# EAGLE design espmarauder (EAGLE 9.6.2)
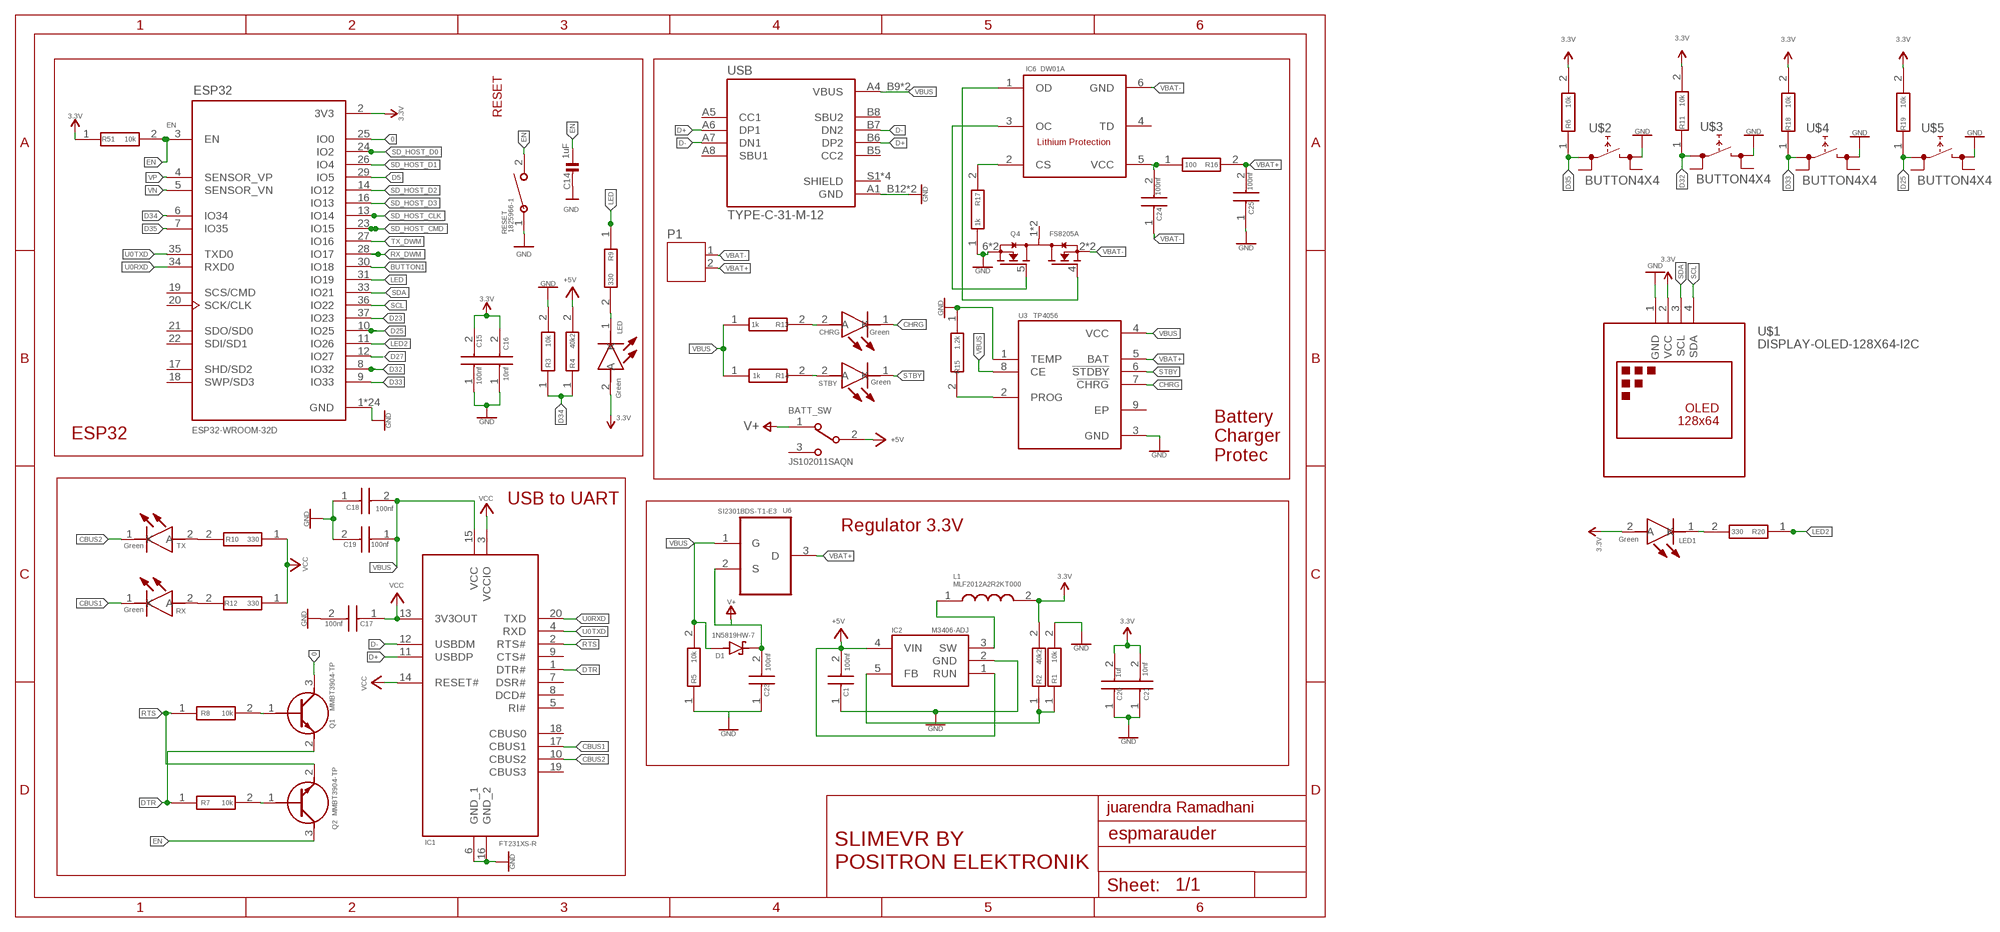
[diagram p0: schematic, sheet 1]

## Parts
BATT_SW  JS102011SAQN  [SW_JS102011SAQN]
C1  100nf  885012206071  [CAPC1608X87N]
C14  1uF  CAP_CERAMIC0603  [0603]
C15  100nf  885012206071  [CAPC1608X87N]
C16  10nf  885012206089  [CAPC1608X87N]
C17  100nf  885012206071  [CAPC1608X87N]
C18  100nf  885012206071  [CAPC1608X87N]
C19  100nf  885012206071  [CAPC1608X87N]
C20  1uf  885012206071  [CAPC1608X87N]
C21  10nf  885012206089  [CAPC1608X87N]
C23  100nf  885012206071  [CAPC1608X87N]
C24  100nf  885012206071  [CAPC1608X87N]
C25  100nf  885012206071  [CAPC1608X87N]
CHRG  Green  150080BS75000  [LEDC2012X80N]
D1  1N5819HW-7  [SOD3715X145N]
ESP32  ESP32-WROOM-32D  [MODULE_ESP32-WROOM-32D]
IC1  FT231XS-R  [SOP64P599X175-20N]
IC2  M3406-ADJ  [SOT95P280X100-5N]
IC6  DW01A  [SOT23-6]
L1  MLF2012A2R2KT000  [INDC2012X105N]
LED  Green  150080BS75000  [LEDC2012X80N]
LED1  Green  150080BS75000  [LEDC2012X80N]
P1  JST-PH2  [JST-PH2]
Q1  MMBT3904-TP  [SI2305TP]
Q2  MMBT3904-TP  [SI2305TP]
Q4  FS8205A  [SOP65P640X120-8N]
R1  10k  ESR03EZPJ103  [RESC1608X55N]
R2  40k2  ERJ-S03F4022V  [RESC1608X55N]
R3  10k  ESR03EZPJ103  [RESC1608X55N]
R4  40k2  ERJ-S03F4022V  [RESC1608X55N]
R5  10k  ESR03EZPJ103  [RESC1608X55N]
R6  10k  ESR03EZPJ103  [RESC1608X55N]
R7  10k  ESR03EZPJ103  [RESC1608X55N]
R8  10k  ESR03EZPJ103  [RESC1608X55N]
R9  330  ERJ-H3EF3300V  [ERJH3]
R10  330  ERJ-H3EF3300V  [ERJH3]
R11  10k  ESR03EZPJ103  [RESC1608X55N]
R12  330  ERJ-H3EF3300V  [ERJH3]
R13  1k  ESR03EZPJ102  [RESC1608X55N]
R14  1k  ESR03EZPJ102  [RESC1608X55N]
R15  1.2k  ESR03EZPJ102  [RESC1608X55N]
R16  100  ESR03EZPJ102  [RESC1608X55N]
R17  1k  ESR03EZPJ102  [RESC1608X55N]
R18  10k  ESR03EZPJ103  [RESC1608X55N]
R19  10k  ESR03EZPJ103  [RESC1608X55N]
R20  330  ERJ-H3EF3300V  [ERJH3]
R51  10k  ESR03EZPJ103  [RESC1608X55N]
RESET  1825966-1  [SWDIP2_256X170P100]
RX  Green  150080BS75000  [LEDC2012X80N]
STBY  Green  150080BS75000  [LEDC2012X80N]
TX  Green  150080BS75000  [LEDC2012X80N]
U3  TP4056  [SOP127P600X175-9N]
U6  SI2301BDS-T1-E3  [SOT95P237X112-3N]
U$1  DISPLAY-OLED-128X64-I2C  [DISPLAY-OLED-128X64-I2C]
U$2  BUTTON4X4  [BUTTON4X4]
U$3  BUTTON4X4  [BUTTON4X4]
U$4  BUTTON4X4  [BUTTON4X4]
U$5  BUTTON4X4  [BUTTON4X4]
USB  TYPE-C-31-M-12  [HRO_TYPE-C-31-M-12]

## Nets
0: ESP32.25(IO0) Q1.3(C)
3.3V: C15.2 C16.2 C20.2 C21.2 ESP32.2(3V3) L1.2 LED1.2(A) LED.2(A) R2.2 R6.2 R11.2 R18.2 R19.2 R51.1 U$1.2(VCC)
+5V: BATT_SW.2 C1.2 IC2.1(RUN) IC2.4(VIN) R4.2
BUTTON1: ESP32.30(IO18)
CBUS1: IC1.17(CBUS1) RX.1(K)
CBUS2: IC1.10(CBUS2) TX.1(K)
CHRG: CHRG.1(K) U3.7(!CHRG)
D5: ESP32.29(IO5)
D23: ESP32.37(IO23)
D25: ESP32.10(IO25) R19.1 U$5.1
D27: ESP32.12(IO27)
D32: ESP32.8(IO32) R11.1 U$3.1
D33: ESP32.9(IO33) R18.1 U$4.1
D34: ESP32.6(IO34) R3.1 R4.1
D35: ESP32.7(IO35) R6.1 U$2.1
D+: IC1.11(USBDP) USB.A6(DP1) USB.B6(DP2)
D-: IC1.12(USBDM) USB.A7(DN1) USB.B7(DN2)
DTR: IC1.1(DTR#) Q1.2(E) R7.1
EN: C14.1 ESP32.3(EN) Q2.3(C) R51.2 RESET.2
GND: C1.1 C14.2 C15.1 C16.1 C17.2 C18.1 C19.2 C20.1 C21.1 C23.1 C25.1 IC1.6(GND_1) IC1.16(GND_2) IC2.2(GND) Q4.6(S2) Q4.7(S2) R1.2 R3.2 R5.1 R15.1 R17.1 RESET.1 U3.1(TEMP) U3.3(GND) U$1.1(GND) U$2.3 U$3.3 U$4.3 U$5.3 USB.A1_B12(GND) USB.B1_A12(GND)
LED: ESP32.31(IO19) R9.1
LED2: ESP32.11(IO26) R20.1
N$1: IC2.3(SW) L1.1
N$2: LED.1(K) R9.2
N$3: IC2.5(FB) R1.1 R2.1
N$4: LED1.1(K) R20.2
N$9: Q2.1(B) R7.2
N$11: Q1.1(B) R8.2
N$12: R12.2 RX.2(A)
N$13: R10.2 TX.2(A)
N$15: CHRG.2(A) R13.2
N$16: R14.2 STBY.2(A)
N$18: R15.2 U3.2(PROG)
N$19: C24.2 IC6.5(VCC) R16.1
N$20: IC6.1(OD) Q4.4(G1)
N$21: IC6.2(CS) R17.2
N$26: IC6.3(OC) Q4.5(G2)
RTS: IC1.2(RTS#) Q2.2(E) R8.1
RX_DWM: ESP32.28(IO17)
SCL: ESP32.36(IO22) U$1.4(SDA)
SD_HOST_CLK: ESP32.13(IO14)
SD_HOST_CMD: ESP32.23(IO15)
SD_HOST_D0: ESP32.24(IO2)
SD_HOST_D1: ESP32.26(IO4)
SD_HOST_D2: ESP32.14(IO12)
SD_HOST_D3: ESP32.16(IO13)
SDA: ESP32.33(IO21) U$1.3(SCL)
STBY: STBY.1(K) U3.6(!STDBY)
TX_DWM: ESP32.27(IO16)
U0RXD: ESP32.34(RXD0) IC1.20(TXD)
U0TXD: ESP32.35(TXD0) IC1.4(RXD)
V+: BATT_SW.1 C23.2 D1.C(K) U6.2(S)
VBAT+: C25.2 P1.2 R16.2 U3.5(BAT) U6.3(D)
VBAT-: C24.1 IC6.6(GND) P1.1 Q4.2(S1) Q4.3(S1)
VBUS: C18.2 C19.1 D1.A IC1.15(VCC) R5.2 R13.1 R14.1 U3.4(VCC) U3.8(CE) U6.1(G) USB.A4_B9(VBUS) USB.B4_A9(VBUS)
VCC: C17.1 IC1.3(VCCIO) IC1.13(3V3OUT) IC1.14(RESET#) R10.1 R12.1
VN: ESP32.5(SENSOR_VN)
VP: ESP32.4(SENSOR_VP)
Unconnected: BATT_SW.3 ESP32.17(SHD/SD2) ESP32.18(SWP/SD3) ESP32.19(SCS/CMD) ESP32.20(SCK/CLK) ESP32.21(SDO/SD0) ESP32.22(SDI/SD1) IC1.5(RI#) IC1.7(DSR#) IC1.8(DCD#) IC1.9(CTS#) IC1.18(CBUS0) IC1.19(CBUS3) IC6.4(TD) Q4.1(D12) Q4.8(D12) U3.9(EP) U$2.2 U$2.4 U$3.2 U$3.4 U$4.2 U$4.4 U$5.2 U$5.4 USB.A5(CC1) USB.A8(SBU1) USB.B5(CC2) USB.B8(SBU2) USB.S1(SHIELD) USB.S2(SHIELD) USB.S3(SHIELD) USB.S4(SHIELD)

## Notes on the sheet
- RESET
- ESP32
- Battery 
  Charger
  Protec
- USB to UART
- Regulator 3.3V
- juarendra Ramadhani
- SLIMEVR BY
  POSITRON ELEKTRONIK

## Power pins joined to a net without a drawn wire
GND: ESP32.1(GND) ESP32.15(GND) ESP32.38(GND) ESP32.39_1(GND) ESP32.39_2(GND) ESP32.39_3(GND) ESP32.39_4(GND) ESP32.39_5(GND) ESP32.39_6(GND) ESP32.39_7(GND) ESP32.39_8(GND) ESP32.39_9(GND) ESP32.39_10(GND) ESP32.39_11(GND) ESP32.39_12(GND) ESP32.39_13(GND) ESP32.39_14(GND) ESP32.39_15(GND) ESP32.39_16(GND) ESP32.39_17(GND) ESP32.39_18(GND) ESP32.39_19(GND) ESP32.39_20(GND) ESP32.39_21(GND)

## Library data of the parts
BATT_SW = JS102011SAQN:JS102011SAQN: JS10 Series SPDT On-On 6 V 0.3 A Gull Wing SMT Slide Switch http://www.snapeda.com/parts/JS102011SAQN/C%26K%20Components/view-part/ Check availability <https://pricing.snapeda.com/parts/JS102011SAQN/C%26K/view-part?ref=eda>; AVAILABILITY: In Stock; CHECK_PRICES: https://www.snapeda.com/parts/JS102011SAQN/C%2526K/view-part/?ref=eda; DESCRIPTION: Slide Switch SPDT Surface Mount, Right Angle; MF: C&K; MP: JS102011SAQN; PACKAGE: None; PRICE: None; PURCHASE-URL: https://pricing.snapeda.com/search?q=JS102011SAQN&ref=eda; SNAPEDA_LINK: https://www.snapeda.com/parts/JS102011SAQN/C%2526K/view-part/?ref=snap
C1 C15 C17-C19 C23-C25 = AccesControlNFC:885012206071: Wurth Elektronik 0603 WCAP-CSGP 100nF Ceramic Multilayer Capacitor, 25 V dc, +125C, X7R Dielectric, +/-10% Source: Datasheet <https://katalog.we-online.com/pbs/datasheet/885012206071.pdf>; DESCRIPTION: Wurth Elektronik 0603 WCAP-CSGP 100nF Ceramic Multilayer Capacitor, 25 V dc, +125C, X7R Dielectric, +/-10%; DIGIKEY_PARTNUMBER: 732-7989-1-ND; DIGIKEY_PRICE-STOCK: https://www.digikey.com/product-detail/en/w%C3%BCrth-elektronik/885012206071/732-7989-1-ND/5454616; HEIGHT: 0.87mm; MANUFACTURER_NAME: Wurth Elektronik; MANUFACTURER_PART_NUMBER: 885012206071; MOUSER_PART_NUMBER: 710-885012206071; MOUSER_PRICE-STOCK: https://www.mouser.co.uk/ProductDetail/Wurth-Elektronik/885012206071?qs=0KOYDY2FL2%2FEBQkuHgvarg%3D%3D
C14 = microbuilder:CAP_CERAMIC: Ceramic Capacitors 0402 - 0402 Surface Mount Capacitors 16pF 50V 5% [Digikey: 445-4899-2-ND] 18pF 50V 5% [Digikey: 490-1281-2-ND] 22pF 50V 5% [Digikey: 490-1283-2-ND] 68pF 50V 5% [Digikey: 490-1289-2-ND] 0.1uF 10V 10% [Digikey: 490-1318-2-ND] 1.0uF 6.3V 10% [Digikey: 490-1320-2-ND] 0603 - 0603 Surface Mount Capacitors 16 pF 50V 5% [Digikey: 445-5051-2-ND] 22 pF 50V [Digikey: PCC220ACVTR-ND] 33 pF 50V 5% [Digikey: 490-1415-1-ND] 56pF 50V 5% [Digikey: 490-1421-1-ND] 220pF 50V 5% [Digikey: 445-1285-1-ND] 680 pF 50V 2200 pF 50V 5% C0G [Digikey: 445-1297-1-ND] 5600 pF 100V 5% X7R [Digikey: 478-3711-1-ND] 0.1 µF 25V 10% [Digikey: PCC2277TR-ND] 0.22 µF 16V 10% X7R [Digikey: 445-1318-1-ND] 1.0 µF 25V 10% [Digikey: 445-5146-2-ND] 0603 - RF Specific 3pF 250V +/-0.1pF RF [Digikey: 712-1347-1-ND] 18 pF 250V 5% [Digikey: 478-3505-1-ND or 712-1322-1-ND] 56 pF 250V 5% C0G RF [Digikey: 490-4867-1-ND] 68 pF 250V RF [Digikey: 490-4868-1-ND] 0805 - 0805 Surface Mount Capacitors 220 pF 250V 2% RF Ceramic Capacitor [Digikey: 712-1398-1-ND] 1000 pF 50V 2% NP0 Ceramic Capacitor [Digikey: 478-3760-1-ND] 0.1 µF 25V 10% Ceramic Capacitor [Digikey: PCC1828TR-ND] 1.0 µF 16V 10% Ceramic Capacitor[Digikey: 490-1691-2-ND] 10.0 µF 10V 10% Ceramic Capacitor[Digikey: 709-1228-1-ND] 10.0 uF 16V 10% Ceramic Capacitor [Digikey: 478-5165-2-ND] 47 uF 6.3V 20% Ceramic Capacitor [Digikey: 587-1779-1-ND or 399-5506-1-ND] 1206 - 1206 Surface Mount Capacitors 47uF 10V 20% Ceramic Capacitor [Digikey: 490-5528-1-ND or 399-5508-1-ND or 445-6010-1-ND] 100uF 6.3V -20%, +80% Y5V Ceramic Capacitor (Digikey: 490-4512-1-ND, Mouser: 81-GRM31CF50J107ZE1L)
C16 C21 = AccesControlNFC:885012206089: Wurth Elektronik 0603 WCAP-CSGP 10nF Ceramic Multilayer Capacitor, 50 V dc, +125C, X7R Dielectric, +/-10% Source: Datasheet <https://katalog.we-online.com/pbs/datasheet/885012206089.pdf>; DESCRIPTION: Wurth Elektronik 0603 WCAP-CSGP 10nF Ceramic Multilayer Capacitor, 50 V dc, +125C, X7R Dielectric, +/-10%; DIGIKEY_PARTNUMBER: 732-8007-1-ND; DIGIKEY_PRICE-STOCK: https://www.digikey.com/product-detail/en/w%C3%BCrth-elektronik/885012206089/732-8007-1-ND/5454634; HEIGHT: 0.87mm; MANUFACTURER_NAME: Wurth Elektronik; MANUFACTURER_PART_NUMBER: 885012206089; MOUSER_PART_NUMBER: 710-885012206089; MOUSER_PRICE-STOCK: https://www.mouser.co.uk/ProductDetail/Wurth-Elektronik/885012206089?qs=0KOYDY2FL28GvSbKh319Tw%3D%3D
C20 = AccesControlNFC:885012206071: Wurth Elektronik 0603 WCAP-CSGP 100nF Ceramic Multilayer Capacitor, 25 V dc, +125C, X7R Dielectric, +/-10% Source: Datasheet <https://katalog.we-online.com/pbs/datasheet/885012206071.pdf>; DESCRIPTION: Wurth Elektronik 0603 WCAP-CSGP 100nF Ceramic Multilayer Capacitor, 25 V dc, +125C, X7R Dielectric, +/-10%; DIGIKEY_PARTNUMBER: 732-7989-1-ND; DIGIKEY_PRICE-STOCK: https://www.digikey.com/product-detail/en/w%C3%BCrth-elektronik/885012206071/732-7989-1-ND/5454616; HEIGHT: 0.87mm; MANUFACTURER_NAME: Wurth Elektronik; MANUFACTURER_PART_NUMBER: 885012206071; MOUSER_PART_NUMBER: 710-885012206071; MOUSER_PRICE-STOCK: https://www.mouser.co.uk/ProductDetail/Wurth-Elektronik/885012206071?qs=0KOYDY2FL2%2FEBQkuHgvarg%3D%3D; VALUE: 100nf
CHRG LED LED1 RX STBY TX = AccesControlNFC:150080BS75000: LED,Wurth Elektronik,150080BS75000 Wurth Elektronik 150080BS75000, WL-SMCW Series Blue LED, 470 nm 2012 (0805) Clear, Rectangle Lens SMD package Source: Datasheet <https://katalog.we-online.com/led/datasheet/150080BS75000.pdf>; DESCRIPTION: LED,Wurth Elektronik,150080BS75000 Wurth Elektronik 150080BS75000, WL-SMCW Series Blue LED, 470 nm 2012 (0805) Clear, Rectangle Lens SMD package; HEIGHT: 0.8mm; MANUFACTURER_NAME: Wurth Elektronik; MANUFACTURER_PART_NUMBER: 150080BS75000; MOUSER_PART_NUMBER: 710-150080BS75000; MOUSER_PRICE-STOCK: https://www.mouser.co.uk/ProductDetail/Wurth-Elektronik/150080BS75000?qs=2kOmHSv6VfT2tBo3UPVqAQ%3D%3D
D1 = 1N5819HW-7:1N5819HW-7: 1N5819HW Series 40 V 1 A Surface Mount Schottky Barrier Rectifier - SOD-123 Check availability <https://pricing.snapeda.com/parts/1N5819HW-7/Diodes%20Inc./view-part?ref=eda>; AVAILABILITY: In Stock; CHECK_PRICES: https://www.snapeda.com/parts/1N5819HW-7/Diodes+Inc./view-part/?ref=eda; DESCRIPTION: Diode Schottky 40 V 1A Surface Mount SOD-123; MF: Diodes Inc.; MP: 1N5819HW-7; PACKAGE: SOD-123 Fairchild Semiconductor; PRICE: None; PURCHASE-URL: https://www.snapeda.com/api/url_track_click_mouser/?unipart_id=51510&manufacturer=Diodes Inc.&part_name=1N5819HW-7&search_term=1n5819; SNAPEDA_LINK: https://www.snapeda.com/parts/1N5819HW-7/Diodes+Inc./view-part/?ref=snap
ESP32 = AccesControlNFC:ESP32-WROOM-32D: Bluetooth, WiFi 802.11b/g/n, Bluetooth v4.2 + EDR, Class 1, 2 and 3 Transceiver Module 2.4GHz ~ 2.5GHz Integrated, Trace Surface Mount Check availability <https://pricing.snapeda.com/parts/ESP32-WROOM-32D/Espressif%20Systems/view-part?ref=eda>; AVAILABILITY: In Stock; DESCRIPTION: Bluetooth, WiFi 802.11b/g/n, Bluetooth v4.2 +EDR, Class 1, 2 and 3 Transceiver Module 2.4GHz ~ 2.5GHz Integrated; MF: Espressif Systems; MP: ESP32-WROOM-32D; PACKAGE: Module Espressif Systems; PRICE: None; PURCHASE-URL: https://pricing.snapeda.com/search/part/ESP32-WROOM-32D/?ref=eda
IC1 = AccesControlNFC:FT231XS-R: FTDI Chip FT231XS-R, Interface RS232, RS422, RS485, SIE, UART 3MBd, 5 V, 20-pin, SSOP Source: Datasheet; DESCRIPTION: FTDI Chip FT231XS-R, Interface RS232, RS422, RS485, SIE, UART 3MBd, 5 V, 20-pin, SSOP; HEIGHT: 1.753mm; MANUFACTURER_NAME: FTDI Chip; MANUFACTURER_PART_NUMBER: FT231XS-R; MOUSER_PART_NUMBER: 895-FT231XS-R; MOUSER_PRICE-STOCK: https://www.mouser.co.uk/ProductDetail/FTDI/FT231XS-R?qs=Gp1Yz1mis3WduRPsgrTbtg%3D%3D
IC2 = M3406:M3406-ADJ: Step-down type SOT-23-5 DC-DC Converters ROHS Source: Datasheet <https://www.lcsc.com/datasheet/lcsc_datasheet_2304140030_XI-AN-Aerosemi-Tech-M3406-ADJ_C83224.pdf>; DESCRIPTION: Step-down type SOT-23-5 DC-DC Converters ROHS; HEIGHT: 1mm; LCSC_PART_NUMBER: C83224; LCSC_PRICE-STOCK: https://www.lcsc.com/product-detail/DC-DC-Converters_XI-AN-Aerosemi-Tech-M3406-ADJ_C83224.html; MANUFACTURER_NAME: XI'AN Aerosemi Tech; MANUFACTURER_PART_NUMBER: M3406-ADJ
IC6 = DW01A:DW01A: Check availability <https://pricing.snapeda.com/parts/DW01A/Fortune%20Semiconductor/view-part?ref=eda>; AVAILABILITY: Not in stock; CHECK_PRICES: https://www.snapeda.com/parts/DW01A/Fortune+Semiconductor/view-part/?ref=eda; DESCRIPTION: One Cell Lithium-ion/Polymer Battery Protection IC; MF: Fortune Semiconductor; MP: DW01A; PACKAGE: SOT-23-6 Fortune Semiconductor; PRICE: None; SNAPEDA_LINK: https://www.snapeda.com/parts/DW01A/Fortune+Semiconductor/view-part/?ref=snap
L1 = MLF2012A2R2KT000:MLF2012A2R2KT000: 2.2 H Shielded Multilayer Inductor 50 mA 500mOhm Max 0805 (2012 Metric) Source: Datasheet <https://product.tdk.com/system/files/dam/doc/product/inductor/inductor/smd/catalog/inductor_commercial_standard_mlf2012_en.pdf>; DESCRIPTION: 2.2 H Shielded Multilayer Inductor 50 mA 500mOhm Max 0805 (2012 Metric); HEIGHT: 1.05mm; MANUFACTURER_NAME: TDK; MANUFACTURER_PART_NUMBER: MLF2012A2R2KT000; MOUSER_PART_NUMBER: 810-MLF2012A2R2KT000; MOUSER_PRICE-STOCK: https://www.mouser.co.uk/ProductDetail/TDK/MLF2012A2R2KT000?qs=pLY5GE0xrmL3Y2Jw%2FEGjFg%3D%3D
P1 = jst-ph:JST-PH2
Q1 Q2 = AccesControlNFC:MMBT3904-TP: Bipolar Transistors - BJT 40V Source: Datasheet <https://componentsearchengine.com/Datasheets/1/MMBT3904-TP.pdf>; DESCRIPTION: Bipolar Transistors - BJT 40V; HEIGHT: mm; MANUFACTURER_NAME: Micro Commercial Components (MCC); MANUFACTURER_PART_NUMBER: MMBT3904-TP; MOUSER_PART_NUMBER: 833-MMBT3904-TP; MOUSER_PRICE-STOCK: https://www.mouser.co.uk/ProductDetail/Micro-Commercial-Components-MCC/MMBT3904-TP?qs=KFo7JewZbUHicjDjIayULQ%3D%3D
Q4 = FS8205A:FS8205A: N/A Check availability <https://pricing.snapeda.com/parts/FS8205A/Fortune%20Semiconductor/view-part?ref=eda>; AVAILABILITY: Not in stock; CHECK_PRICES: https://www.snapeda.com/parts/FS8205A/Fortune+Semiconductor/view-part/?ref=eda; MF: Fortune Semiconductor; MP: FS8205A; PACKAGE: Package; PRICE: None; SNAPEDA_LINK: https://www.snapeda.com/parts/FS8205A/Fortune+Semiconductor/view-part/?ref=snap
R1 R3 R5-R8 R11 R18 R19 R51 = AccesControlNFC:ESR03EZPJ103: Thick Film Resistors - SMD 0603 10Kohm 5% Anti Surge AEC-Q200 Source: Datasheet <https://componentsearchengine.com/Datasheets/1/ESR03EZPJ103.pdf>; DESCRIPTION: Thick Film Resistors - SMD 0603 10Kohm 5% Anti Surge AEC-Q200; DIGIKEY_PARTNUMBER: RHM10KDCT-ND; DIGIKEY_PRICE-STOCK: https://www.digikey.com/product-detail/en/rohm-semiconductor/ESR03EZPJ103/RHM10KDCT-ND/1762925; HEIGHT: 0.55mm; MANUFACTURER_NAME: ROHM Semiconductor; MANUFACTURER_PART_NUMBER: ESR03EZPJ103; MOUSER_PART_NUMBER: 755-ESR03EZPJ103; MOUSER_PRICE-STOCK: https://www.mouser.com/Search/Refine.aspx?Keyword=755-ESR03EZPJ103
R2 R4 = ERJ-S03F4022V:ERJ-S03F4022V: Thick Film Resistors - SMD 0603 40.2Kohms 1% Anti-Sulfur Source: Datasheet <https://componentsearchengine.com/Datasheets/1/ERJ-S03F4022V.pdf>; DESCRIPTION: Thick Film Resistors - SMD 0603 40.2Kohms 1% Anti-Sulfur; HEIGHT: 0.55mm; MANUFACTURER_NAME: Panasonic; MANUFACTURER_PART_NUMBER: ERJ-S03F4022V; MOUSER_PART_NUMBER: 667-ERJ-S03F4022V; MOUSER_PRICE-STOCK: https://www.mouser.com/Search/Refine.aspx?Keyword=667-ERJ-S03F4022V
R9 R10 R12 R20 = AccesControlNFC:ERJ-H3EF3300V: Power Rating 0.125W,Resistance 330 Ohm,LxW(EIA) 1.6 x 0.8 (EIA:0603) mm Source: Datasheet <http://industrial.panasonic.com/cdbs/www-data/pdf/RDQ0000/ast-ind-151033.pdf>; DESCRIPTION: Power Rating 0.125W,Resistance 330 Ohm,LxW(EIA) 1.6 x 0.8 (EIA:0603) mm; HEIGHT: mm; MANUFACTURER_NAME: Panasonic; MANUFACTURER_PART_NUMBER: ERJ-H3EF3300V; MOUSER_PART_NUMBER: 667-ERJ-H3EF3300V; MOUSER_PRICE-STOCK: https://www.mouser.co.uk/ProductDetail/Panasonic/ERJ-H3EF3300V?qs=eP2BKZSCXI61roRLPi8W7w%3D%3D
R13 R14 R17 = AccesControlNFC:ESR03EZPJ102: Thick Film Resistors - SMD 0603 1Kohm 5% Anti Surge AEC-Q200 Source: Datasheet <http://www.rohm.com/web/global/datasheet/ESR01MZPF/esr-e>; DESCRIPTION: Thick Film Resistors - SMD 0603 1Kohm 5% Anti Surge AEC-Q200; DIGIKEY_PARTNUMBER: RHM1.0KDCT-ND; DIGIKEY_PRICE-STOCK: https://www.digikey.com/product-detail/en/rohm-semiconductor/ESR03EZPJ102/RHM1-0KDCT-ND/1762924; HEIGHT: 0.55mm; MANUFACTURER_NAME: ROHM Semiconductor; MANUFACTURER_PART_NUMBER: ESR03EZPJ102; MOUSER_PART_NUMBER: 755-ESR03EZPJ102; MOUSER_PRICE-STOCK: https://www.mouser.co.uk/ProductDetail/ROHM-Semiconductor/ESR03EZPJ102?qs=DyUWGjl%252BcVvjMuV%252BzioV7Q%3D%3D
R15 R16 = AccesControlNFC:ESR03EZPJ102: Thick Film Resistors - SMD 0603 1Kohm 5% Anti Surge AEC-Q200 Source: Datasheet <http://www.rohm.com/web/global/datasheet/ESR01MZPF/esr-e>; DESCRIPTION: Thick Film Resistors - SMD 0603 1Kohm 5% Anti Surge AEC-Q200; DIGIKEY_PARTNUMBER: RHM1.0KDCT-ND; DIGIKEY_PRICE-STOCK: https://www.digikey.com/product-detail/en/rohm-semiconductor/ESR03EZPJ102/RHM1-0KDCT-ND/1762924; HEIGHT: 0.55mm; MANUFACTURER_NAME: ROHM Semiconductor; MANUFACTURER_PART_NUMBER: ESR03EZPJ102; MOUSER_PART_NUMBER: 755-ESR03EZPJ102; MOUSER_PRICE-STOCK: https://www.mouser.co.uk/ProductDetail/ROHM-Semiconductor/ESR03EZPJ102?qs=DyUWGjl%252BcVvjMuV%252BzioV7Q%3D%3D; VALUE: 1k
RESET = Switches:1825966-1; BUILT_BY: EMA_UL_Team; CATEGORY: Tactile Switches; COPYRIGHT: Copyright (C) 2016 Accelerated Designs. All rights reserved; DESCRIPTION: FSMCH=3.5 X 6.0 X 4.3 TACT SWITCH, HT; MANUFACTURER_PART_NUMBER: 1825966-1; PART_STATUS: active; SERIES: Unknown; VENDOR: TE Connectivity
U3 = TP4056:TP4056: Complete single cell Li-Ion battery with a constant current / constant voltage linear charger Check availability <https://pricing.snapeda.com/parts/TP4056/NanJing%20Top%20Power%20ASIC%20Corp./view-part?ref=eda>; AVAILABILITY: Not in stock; CHECK_PRICES: https://www.snapeda.com/parts/TP4056/NanJing+Top+Power+ASIC+Corp./view-part/?ref=eda; DESCRIPTION: Complete single cell Li-Ion battery with a constant current / constant voltage linear charger; MF: NanJing Top Power ASIC Corp.; MP: TP4056; PACKAGE: Package; PRICE: None; SNAPEDA_LINK: https://www.snapeda.com/parts/TP4056/NanJing+Top+Power+ASIC+Corp./view-part/?ref=snap
U6 = SI2301BDS-T1-E3:SI2301BDS-T1-E3: MOSFET Check availability <https://pricing.snapeda.com/parts/SI2301BDS-T1-E3/Vishay/view-part?ref=eda>; AVAILABILITY: In Stock; CHECK_PRICES: https://www.snapeda.com/parts/SI2301BDS-T1-E3/Vishay+Siliconix/view-part/?ref=eda; DESCRIPTION: MOSFET,P-Ch,VDSS -20V,RDS(ON) 0.08Ohm,ID -2.2A,TO-236 (SOT-23),PD 0.7W,VGS +/-8V | Siliconix / Vishay SI2301BDS-T1-E3; MF: Vishay; MP: SI2301BDS-T1-E3; PACKAGE: SOT-23-3 Vishay Siliconix; PRICE: None; PURCHASE-URL: https://www.snapeda.com/api/url_track_click_mouser/?unipart_id=277675&manufacturer=Vishay&part_name=SI2301BDS-T1-E3&search_term=si2301; SNAPEDA_LINK: https://www.snapeda.com/parts/SI2301BDS-T1-E3/Vishay+Siliconix/view-part/?ref=snap
U$1 = diy-modules:DISPLAY-OLED-128X64-I2C: 128x64 Dot Matrix OLED Module based on SSD1306 chip Variant with I2C interface More details available here: http://www.instructables.com/id/Monochrome-096-i2c-OLED-display-with-arduino-SSD13/ SSD1306 datasheet: https://cdn-shop.adafruit.com/datasheets/SSD1306.pdf Click here to find device on ebay.com <http://www.ebay.com/sch/oled+display+128x64+iic> Note: There are two variants: I2C and SPI. Search for the proper version.
U$2-U$5 = 4x4mm_Push_Button:BUTTON4X4: 10x 10pcs 4*4*1.5mm Surface Mount Tactile Pushbutton Switch 4x4 SMD Tact Micro
USB = TYPE-C-31-M-12:TYPE-C-31-M-12: Check availability <https://pricing.snapeda.com/parts/TYPE-C-31-M-12/HRO%20Electronics%20Co.%2C%20Ltd./view-part?ref=eda>; AVAILABILITY: Not in stock; CHECK_PRICES: https://www.snapeda.com/parts/TYPE-C-31-M-12/HRO+Electronics+Co.%252C+Ltd./view-part/?ref=eda; DESCRIPTION: USB Connectors 24 Receptacle 1 8.94*7.3mm RoHS; MF: HRO Electronics Co., Ltd.; MP: TYPE-C-31-M-12; PACKAGE: Package; PRICE: None; SNAPEDA_LINK: https://www.snapeda.com/parts/TYPE-C-31-M-12/HRO+Electronics+Co.%252C+Ltd./view-part/?ref=snap

## Net classes
1 highpower: width 0.406 mm, drill 0.483 mm

## Board
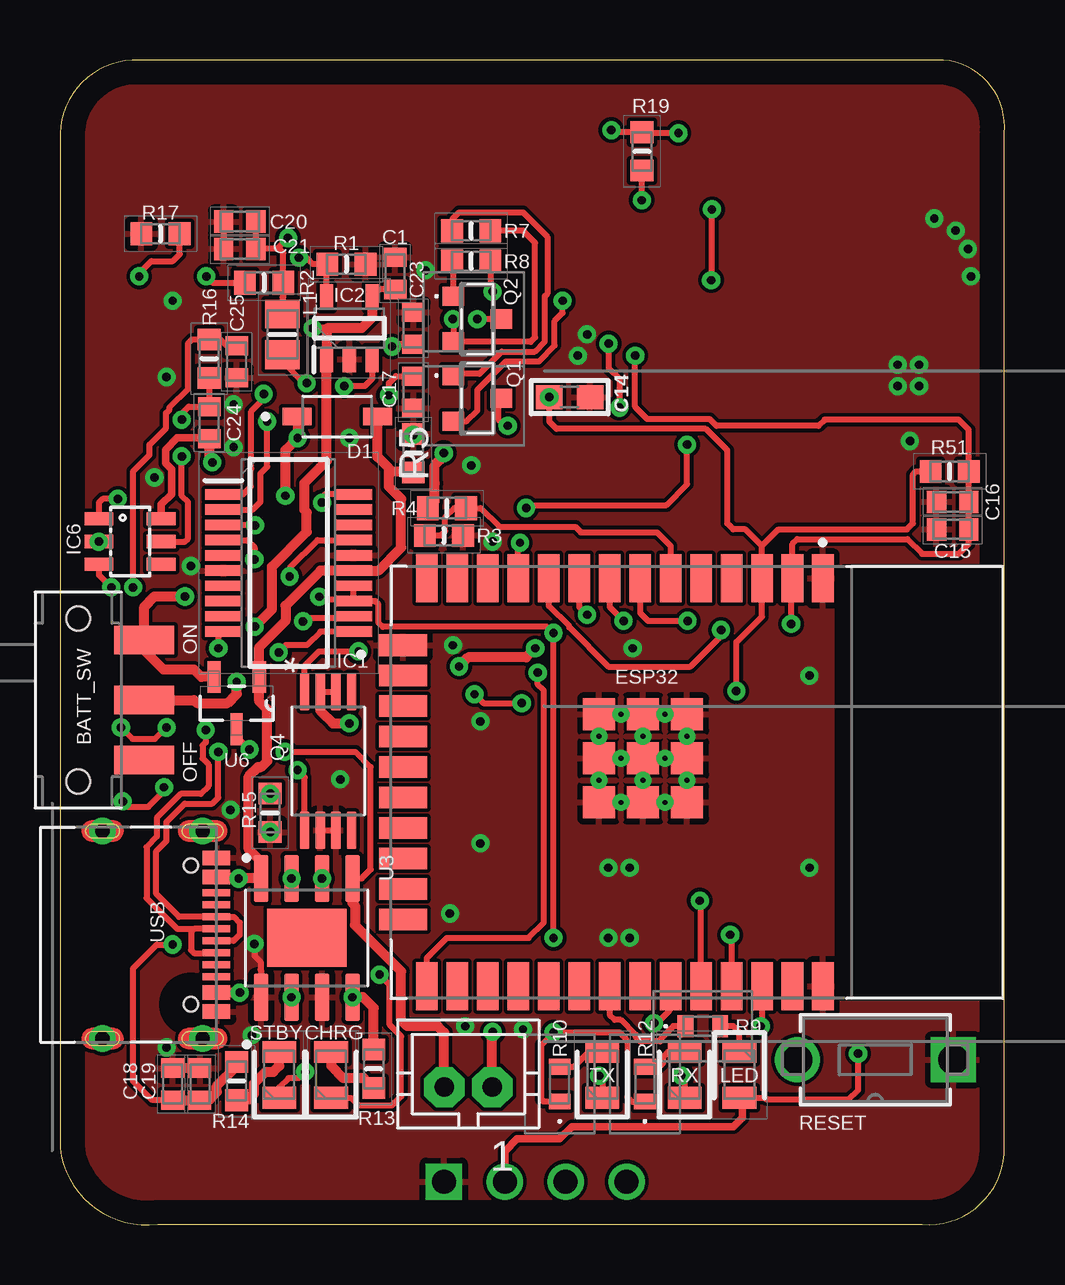
[diagram p1: board, top side]
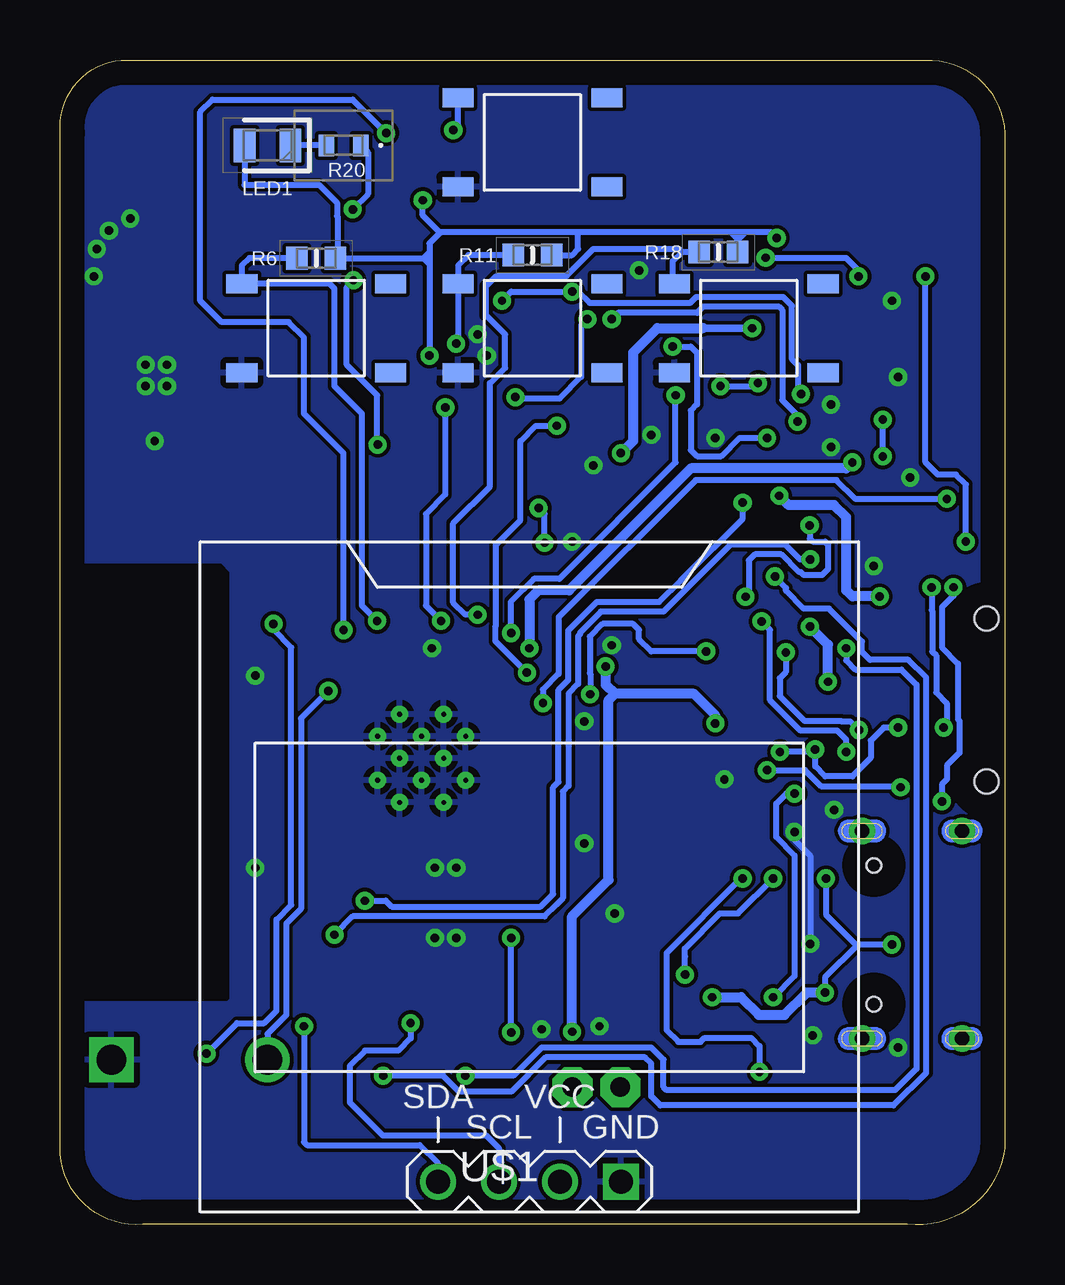
[diagram p2: board, bottom side, seen from below]

Size 39.38 x 48.54 mm. Coordinates in mm from the lower left corner, seen from the top.
Outline: 0,45.49 0,3.2 arc90 4.06,0.03 35.94,0.03 arc90 39.37,2.95 39.37,45.49 arc90 36.83,48.54 3.3,48.54 arc90 0,45.49
Copper layers (1*16): Top 0.035mm / dielectric 1.5mm / Bottom 0.035mm
Design rules "default *": minimum track width 6mil, minimum drill 0.35mm, track to track 6mil, track to pad 6mil, pad to pad 6mil, via to via 6mil, smd to smd 6mil, copper to edge 40mil, drill to drill 6mil, minimum pad ring 10mil, minimum via ring 8mil, stop-mask expansion 4mil, vias tented up to drill 0.36mm, thermal gap 10mil

### Footprints (pad centres in the part's own frame; a part is rotated, then mirrored left to right if it is on the bottom)
SW_JS102011SAQN = smd 1.2 x 2.5: 1 -2.5,2.75; 2 0,2.75; 3 2.5,2.75 | hole 1: -3.4,0; 3.4,0
CAPC1608X87N = smd 0.8 x 0.94: 1 -0.67,0; 2 0.67,0
0603 = smd 1.1 x 1: 1 -0.85,0; 2 0.85,0
LEDC2012X80N = smd 0.9 x 1.4: 1 -0.95,0; 2 0.95,0
SOD3715X145N = smd 1.21 x 0.73: A 1.68,0; C -1.68,0
MODULE_ESP32-WROOM-32D = smd 2 x 0.9: 1 -8.5,5.26; 2 -8.5,3.99; 3 -8.5,2.72; 4 -8.5,1.45; 5 -8.5,0.18; 6 -8.5,-1.09; 7 -8.5,-2.36; 8 -8.5,-3.63; 9 -8.5,-4.9; 10 -8.5,-6.17; 11 -8.5,-7.44; 12 -8.5,-8.71; 13 -8.5,-9.98; 14 -8.5,-11.25; 25 8.5,-11.25; 26 8.5,-9.98; 27 8.5,-8.71; 28 8.5,-7.44; 29 8.5,-6.17; 30 8.5,-4.9; 31 8.5,-3.63; 32 8.5,-2.36; 33 8.5,-1.09; 34 8.5,0.18; 35 8.5,1.45; 36 8.5,2.72; 37 8.5,3.99; 38 8.5,5.26 | smd 0.9 x 2: 15 -5.715,-12.25; 16 -4.445,-12.25; 17 -3.175,-12.25; 18 -1.905,-12.25; 19 -0.635,-12.25; 20 0.635,-12.25; 21 1.905,-12.25; 22 3.175,-12.25; 23 4.445,-12.25; 24 5.715,-12.25 | smd 1.33 x 1.33: 39_1 -2.835,-0.405; 39_2 -1,-0.405; 39_3 0.835,-0.405; 39_4 -2.835,-2.24; 39_5 -1,-2.24; 39_6 0.835,-2.24; 39_7 -2.835,-4.075; 39_8 -1,-4.075; 39_9 0.835,-4.075 | drill 0.2 pad 0.3: 39_10 -1.917,-0.405; 39_11 -0.083,-0.405; 39_12 -2.835,-1.323; 39_13 -1,-1.323; 39_14 0.835,-1.323; 39_15 -1.917,-2.24; 39_16 -0.083,-2.24; 39_17 -2.835,-3.158; 39_18 -1,-3.158; 39_19 0.835,-3.158; 39_20 -1.917,-4.075; 39_21 -0.083,-4.075
SOP64P599X175-20N = smd 1.526 x 0.435: 1 -2.712,2.858; 2 -2.712,2.222; 3 -2.712,1.588; 4 -2.712,0.952; 5 -2.712,0.318; 6 -2.712,-0.318; 7 -2.712,-0.952; 8 -2.712,-1.588; 9 -2.712,-2.222; 10 -2.712,-2.858; 11 2.712,-2.858; 12 2.712,-2.222; 13 2.712,-1.588; 14 2.712,-0.952; 15 2.712,-0.318; 16 2.712,0.318; 17 2.712,0.952; 18 2.712,1.588; 19 2.712,2.222; 20 2.712,2.858
SOT95P280X100-5N = smd 1.05 x 0.55: 1 -1.3,0.95; 2 -1.3,0; 3 -1.3,-0.95; 4 1.3,-0.95; 5 1.3,0.95
SOT23-6 = smd 0.55 x 1.2: 1 -0.95,-1.3; 2 0,-1.3; 3 0.95,-1.3; 4 0.95,1.3; 5 0,1.3; 6 -0.95,1.3
INDC2012X105N = smd 1.2 x 1.45: 1 -0.85,0; 2 0.85,0
JST-PH2 = drill 0.813 pad 1.676 octagon: 1 1,0; 2 -1,0
SI2305TP = smd 0.8 x 0.9: 1 -0.95,-1; 2 0.95,-1; 3 0,1
SOP65P640X120-8N = smd 1.56 x 0.4: 1 -2.88,0.975; 2 -2.88,0.325; 3 -2.88,-0.325; 4 -2.88,-0.975; 5 2.88,-0.975; 6 2.88,-0.325; 7 2.88,0.325; 8 2.88,0.975
RESC1608X55N = smd 0.9 x 0.95: 1 -0.8,0; 2 0.8,0
RESC1608X55N' = smd 0.9 x 1: 1 -0.8,0; 2 0.8,0
ERJH3 = smd 0.65 x 0.9: 1 -0.725,0; 2 0.725,0
SWDIP2_256X170P100 = drill 1.245 pad 1.753 square: 1 -6.502,0 | drill 1.245 pad 1.753: 2 0,0
SOP127P600X175-9N = smd 1.97 x 0.6: 1 -2.475,1.905; 2 -2.475,0.635; 3 -2.475,-0.635; 4 -2.475,-1.905; 5 2.475,-1.905; 6 2.475,-0.635; 7 2.475,0.635; 8 2.475,1.905 | smd 2.413 x 3.302: 9 0,0
SOT95P237X112-3N = smd 1.321 x 0.559: 1 -1.092,0.94; 2 -1.092,-0.94 | smd 1.321 x 0.508: 3 1.092,0
DISPLAY-OLED-128X64-I2C = drill 1 square: 1 -3.81,12.7 | drill 1: 2 -1.27,12.7; 3 1.27,12.7; 4 3.81,12.7
BUTTON4X4 = smd 1.3 x 0.8: 1 -3.1,1.85; 2 3.1,1.85; 3 -3.1,-1.85; 4 3.1,-1.85
HRO_TYPE-C-31-M-12 = smd 0.6 x 1.14: A1_B12 -3.2,4.75; A4_B9 -2.4,4.75; B1_A12 3.2,4.75; B4_A9 2.4,4.75 | smd 0.3 x 1.14: A5 -1.25,4.75; A6 -0.25,4.75; A7 0.25,4.75; A8 1.25,4.75; B5 1.75,4.75; B6 0.75,4.75; B7 -0.75,4.75; B8 -1.75,4.75 | drill 0.6 pad 0.9: S1 -4.325,4.17; S2 4.325,4.17; S3 -4.325,0; S4 4.325,0 | hole 0.6: -2.89,3.68; 2.89,3.68

### Placement (x,y rotation side)
BATT_SW  0.76,21.87 270 top
C1  13.97,39.65 270 top
C14  21.25,34.49 0 top
C15  37.21,28.98 0 top
C16  37.21,30.12 0 top
C17  14.73,34.7 270 top
C18  4.7,5.87 270 top
C19  5.84,5.87 90 top
C20  7.49,41.81 0 top
C21  7.49,40.67 0 top
C23  14.73,37.36 270 top
C24  6.22,33.43 90 top
C25  7.37,35.97 90 top
CHRG  11.3,6.25 90 top
D1  11.56,33.68 0 top
ESP32  26.54,18.44 270 top
IC1  9.53,27.58 0 top
IC2  12.06,37.36 90 top
IC6  2.92,28.47 270 top
L1  9.27,37.11 90 top
LED  28.32,6.25 270 top
LED1  30.73,44.98 180 bottom
P1  17.02,5.74 0 top
Q1  17.4,34.44 270 top
Q2  17.4,37.74 270 top
Q4  11.18,19.33 270 top
R1  11.94,40.03 0 top
R2  40k2  [RESC1608X55N']  8.51,39.27 0 top
R3  16,28.73 0 top
R4  40k2  [RESC1608X55N']  16.13,29.87 180 top
R5  14.73,32.16 270 top
R6  28.7,40.28 0 bottom
R7  17.15,40.16 180 top
R8  17.15,41.43 180 top
R9  26.8,8.28 0 top
R10  20.83,5.87 90 top
R11  19.68,40.41 0 bottom
R12  24.38,5.87 90 top
R13  13.08,6.5 270 top
R14  7.37,5.99 270 top
R15  8.76,17.17 90 top
R16  6.22,36.09 90 top
R17  4.19,41.3 0 top
R18  11.94,40.54 0 bottom
R19  24.26,44.73 270 top
R20  27.56,44.98 180 bottom
R51  37.08,31.39 180 top
RESET  30.73,6.88 180 top
RX  26.03,6.25 90 top
STBY  9.14,6.25 90 top
TX  22.61,6.25 90 top
U3  10.29,11.96 90 top
U6  7.37,21.74 270 top
U$1  19.81,14.5 180 bottom
U$2  28.7,37.36 0 bottom
U$3  19.68,37.36 0 bottom
U$4  10.67,37.36 0 bottom
U$5  19.68,45.11 0 bottom
USB  1.78,12.09 270 top

### Tracks (layer width: path | path; a pad name or v marks a point on that pad's centre or on a via)
0  (via drill 0.35)
  Top 0.254: ESP32.25 15.29,11.13 16.13,11.96 19.53,11.96 20.17,12.6 20.17,22.28 19.92,22.53 v19.92,23.01 | v18.67,33.3 18.54,33.3 18.29,33.55 18.29,34.33 Q1.3
  Bottom 0.254: v19.92,23.01 21.23,24.33 21.23,24.94 21.21,24.96 21.21,28.35 20.19,29.36 20.19,32.66 19.56,33.3 v18.67,33.3
3.3V  (via drill 0.35)
  Top 0.254: C20.2 C21.2 9.05,40.67 | 9.05,40.67 9.14,40.67 9.31,40.5 R2.2 9.31,38.67 9.27,38.63 L1.2 | v33.27,7.14 33.27,5.61 32.89,5.23 29.46,5.23 29.4,5.3 28.45,5.3 LED.2 | v30.48,25.04 30.48,26.89 ESP32.2 30.53,28.37 30.73,28.58 35.33,28.58 35.94,27.97 37.46,27.97 37.88,28.38 C15.2 C16.2 R51.1 37.88,33.13 37.46,33.55 31.88,33.55 31.62,33.3 27.37,33.3 27.09,33.58 24.49,33.58 23.98,34.09 v23.98,36.22 | v9.51,41.13 9.05,40.67 | v24.26,42.7 R19.2
  Top 0.305: 28.45,5.3 28.45,4.47 28.07,4.09 21.34,4.09 20.83,3.58 19.05,3.58 18.54,3.07 U$1.2
  Bottom 0.254: v33.27,7.14 32,8.41 30.86,8.41 30.35,8.92 30.35,12.73 29.74,13.34 29.74,24.05 30.48,24.79 v30.48,25.04 | 23.54,41.34 23.5,41.38 17.78,41.38 | 23.54,41.34 23.98,40.9 23.98,40.54 | v9.51,41.13 9.76,41.38 10.79,41.38 | 17.78,41.38 11.43,41.38 | 11.43,41.38 10.79,41.38 | 23.98,40.54 23.98,40.03 | 23.98,40.03 v23.98,36.22 | R11.2 18.03,40.41 17.78,40.67 17.78,41.38 | R18.2 11.14,41.03 | 11.14,41.03 10.79,41.38 | 11.14,41.03 11.14,41.08 11.43,41.38 | R6.2 27.81,40.28 | 27.81,40.28 24.23,40.28 | 24.23,40.28 23.98,40.03 | 24.23,40.28 23.98,40.54 | 23.54,41.34 24.26,42.06 v24.26,42.7 | LED1.2 31.68,43.33 28.57,43.33 27.84,42.59 27.84,42.04 27.81,42.02 27.81,40.28
+5V  (via drill 0.35)
  Top 0.254: C1.2 13.33,38.98 IC2.4
  Top 0.305: v10.53,37.36 11.43,37.36
  Top 0.406: IC2.4 13.01,37.81 12.57,37.36 11.43,37.36 11.18,37.36 11.12,37.3 IC2.1 11.12,31.84 10.19,30.91 10.19,29.79 10.29,29.69 10.29,28.88 8.84,27.43 8.84,25.65 v8.12,24.93 | v16,32.16 16,32.03 15.62,31.65 15.62,30.9 15.62,30.16 R4.2 | BATT_SW.2 5.59,21.87 5.72,21.74 6.99,21.74 7.37,22.12 v7.37,22.63
  Bottom 0.305: 12.57,37.36 v10.53,37.36
  Bottom 0.406: v16,32.16 15.49,32.66 15.49,36.35 14.48,37.36 12.57,37.36 | v7.37,22.63 7.37,24.18 v8.12,24.93
CBUS1  (via drill 0.35)
  Top 0.254: IC1.17 10.73,28.54 9.57,27.38 v9.57,27.02 | v25.91,6.22 26.03,6.09 RX.1
  Bottom 0.254: v25.91,6.22 23.41,6.22 22.75,5.56 20.56,5.56 19.14,6.99 14.99,6.99 14.73,6.73 14.73,5.36 14.35,4.98 4.63,4.98 3.28,6.33 3.28,22.81 4.01,23.55 5.61,23.55 5.95,23.88 5.95,24.3 7.33,25.68 8.38,25.68 9.12,26.42 9.12,26.54 9.57,27 v9.57,27.02
CBUS2  (via drill 0.35)
  Top 0.254: v22.48,6.22 22.61,6.09 TX.1 | IC1.10 6.6,24.52 v6.6,24.03
  Bottom 0.254: v22.48,6.22 20.48,6.22 19.3,7.39 14.73,7.39 14.22,6.88 14.22,5.74 14.1,5.61 4.57,5.61 3.68,6.5 3.68,22.52 4.31,23.14 6.22,23.14 6.6,23.52 v6.6,24.03
CHRG  (via drill 0.35)
  Top 0.254: CHRG.1 12.13,5.3 12.45,4.98 13.84,4.98 14.22,5.36 14.22,7.85 13.74,8.33 13.74,10.01 v13.32,10.43
  Bottom 0.254: v13.32,10.43 13.32,11.19 13.33,11.2 13.33,11.52 11.87,12.98 11.11,12.98 U3.7
  other vias: 9.65,14.44
D25  (via drill 0.35)
  Top 0.254: v22.99,45.62 23.08,45.53 R19.1 24.3,45.49 v25.78,45.49 | ESP32.10 20.37,25.79 21.23,24.94 21.23,24.89 22.86,23.27 26.29,23.27 27.56,24.54 v27.56,24.79
  Bottom 0.254: v22.99,45.62 22.78,45.82 U$5.1 | v27.56,24.79 27.56,32.16 29.21,33.81 29.21,36.98 29.84,37.62 32.64,37.62 33.53,38.51 33.53,46.38 33.02,46.89 27.18,46.89 v25.78,45.49
D32  (via drill 0.35)
  Top 0.254: v22.87,36.72 22.87,35.7 23.32,35.25 v23.32,34.06 | v23.49,25.17 22.91,25.75 22.91,25.81 ESP32.8
  Bottom 0.254: R11.1 22.35,40.41 22.78,39.98 U$3.1 22.78,36.8 v22.87,36.72 | v23.32,34.06 23.32,30.43 24.13,29.62 24.13,25.81 v23.49,25.17
D33  (via drill 0.35)
  Top 0.254: ESP32.9 21.64,25.75 v21.97,25.43
  Bottom 0.254: R18.1 13.46,40.54 | 13.46,40.54 13.84,40.16 13.84,39.29 U$4.1 | v21.97,25.43 22.48,25.43 22.99,25.93 22.99,29.24 21.46,30.76 21.46,35.08 20.83,35.71 20.83,37.11 21.61,37.89 21.61,39.12 21.21,39.52 18.33,39.52 18.31,39.55 18.27,39.55 17.15,40.67 13.59,40.67 13.46,40.54
D34
  Top 0.254: ESP32.6 25.45,28.29 24.89,28.85 21.72,28.85 21.49,29.08 18.31,29.08 17.53,29.87 R4.1 16.44,29.87 16.06,29.49 16.06,28.91 15.88,28.73 R3.1
D35  (via drill 0.35)
  Top 0.254: ESP32.7 24.18,25.5 24.51,25.17 v26.16,25.17
  Bottom 0.254: R6.1 31.5,40.28 31.8,39.98 U$2.1 28.14,39.21 27.94,39.01 27.94,34.95 26.8,33.81 26.8,25.81 v26.16,25.17
D+  (via drill 0.35)
  Top 0.254: USB.A6 5.58,12.34 | 5.58,12.34 5.46,12.22 5.46,11.46 5.59,11.33 6.52,11.33 USB.B6 | IC1.11 10.86,24.73 10.29,24.16 9.42,24.16 v9.12,23.86 | v6.08,20.62 6.08,20.11 5.95,19.98 5.95,19.44 6.2,19.19 6.2,18.29 5.87,17.96 5.04,17.96 4.04,16.96 4.04,16.18 3.61,15.75 3.61,13.62 4.89,12.34 5.58,12.34
  Bottom 0.254: v9.12,23.86 9.12,23.04 9.37,22.78 9.37,22.04 8.34,21.01 6.82,21.01 6.79,20.98 6.44,20.98 v6.08,20.62
D-  (via drill 0.35)
  Top 0.254: USB.A7 7.24,11.84 7.49,12.09 7.49,12.6 7.25,12.84 USB.B7 4.97,12.84 4.01,13.79 4.01,15.58 4.45,16.01 4.45,16.79 5.21,17.55 6.35,17.55 6.6,17.81 v6.6,19.71 | v10.13,25.15 10.28,25.3 12.17,25.3 IC1.12
  Bottom 0.254: v6.6,19.71 6.6,20.22 6.99,20.6 8.51,20.6 9.78,21.87 9.78,24.8 v10.13,25.15
DTR  (via drill 0.35)
  Top 0.254: IC1.1 7.63,30.44 7.95,30.76 7.95,31.49 7.98,31.51 7.98,33.9 8.49,34.42 v8.49,34.62 | v18.03,38.89 17.95,38.98 R7.1 | Q1.2 16.96,33.49 17.4,33.93 17.4,34.8 18.58,35.98 19.96,35.98 20.62,36.65 20.62,37.67 20.95,38 v20.95,38.51
  Bottom 0.254: v8.49,34.62 8.62,34.75 8.62,35.82 8.87,36.07 8.87,38.29 9.23,38.66 12.87,38.66 13.12,38.4 17.3,38.4 17.78,38.89 v18.03,38.89 20.57,38.89 v20.95,38.51
EN  (via drill 0.35)
  Top 0.254: Q2.3 v17.4,37.74 | 29.26,28.29 ESP32.3 29.26,25.35 28.19,24.28 v28.19,22.25 | C14.1 20.4,33.48 20.7,33.17 26.92,33.17 27.81,32.28 27.81,29.24 28.07,28.98 28.57,28.98 29.26,28.29 | 29.26,28.29 29.95,28.98 35.31,28.98 35.56,29.24 35.56,31.27 35.69,31.39 R51.2
  Bottom 0.254: v17.4,37.74 17.65,37.49 17.65,35.33 18.54,34.44 20.35,34.44 C14.1 | v28.19,22.25 29.34,21.11 29.34,13.17 29.95,12.56 29.95,8.75 30.73,7.96 RESET.2
  other vias: 20.4,34.49
GND  (via drill 0.35)
  Top 0.254: C20.1 C21.1 | Q4.6 Q4.7 | v8.11,11.71 8.11,11.22 8.36,10.97 8.36,10.64 8.38,10.62 U3.1
  Top 0.406: C19.2 C18.1
  Bottom 0.254: v8.76,16.37 8.76,16.05 8.11,15.39 v8.11,11.71
  other vias: 37.85,40.67 21.97,37.11 15.24,39.78 37.34,41.43 36.45,41.94 37.97,39.52 21.59,36.22 17.15,31.65 18.03,28.47 17.53,20.98 23.88,24.03 22.86,14.88 17.53,15.9 16.26,12.98 22.86,11.96 19.3,8.15 16.89,8.28 23.75,14.88 31.24,14.88 23.75,11.96 7.11,17.3 11.68,18.57 8,7.9 4.45,7.39 16.38,24.16 5.46,27.46 4.45,35.33 31.24,22.89 35.43,32.66 34.92,34.95 35.81,34.95 35.81,35.84 34.92,35.84 7.24,34.19 7.24,32.41 12.06,32.79 4.7,38.51 3.94,31.14 14.73,32.92
  pour Bottom: -0.13,-0.1 39.88,-0.1 39.88,9.3 32.38,9.3 32.26,9.42 32.26,27.2 32.64,27.58 39.37,27.58 39.5,27.71 39.5,49.17 -0.13,49.17
  pour Top: 39.88,9.3 32.38,9.3 32.26,9.42 32.26,27.2 32.64,27.58 39.37,27.58 39.5,27.71 39.5,49.3 -0.13,49.3 -0.13,-0.1 39.88,-0.1
LED
  Top 0.254: ESP32.31 22.91,8.76 23.13,8.55 23.38,8.55 23.99,7.93 23.99,7.85 24.2,7.65 25.02,7.65 25.06,7.68 25.06,7.76 25.57,8.28 R9.1
LED2  (via drill 0.35)
  Top 0.254: ESP32.11 19.1,28.35 v19.18,28.43 | v19.43,29.87 19.56,30 25.27,30 26.14,30.86 v26.14,32.51 | v27.15,39.36 27.18,39.4 v27.18,42.32
  Bottom 0.254: v19.18,28.43 19.18,29.62 v19.43,29.87 | v26.14,32.51 26.16,32.54 26.16,34.57 27.43,35.84 27.43,39.08 v27.15,39.36 | R20.1 26.54,44.69 26.54,42.95 v27.18,42.32
N$1  (via drill 0.35)
  Top 0.254: IC2.3 13.01,35.27 12.7,34.95 v11.85,34.95 | v10.29,35.08 10.16,35.08 9.27,35.97 L1.1
  Bottom 0.254: v11.85,34.95 10.41,34.95 v10.29,35.08
N$2
  Top 0.254: LED.1 28.32,8.03 28.07,8.28 R9.2
N$3  (via drill 0.35)
  Top 0.254: IC2.5 11.12,40.01 R1.1 10.54,40.03 10.27,40.3 v9.97,40.3 | v6.1,39.52 6.35,39.27 R2.1
  Bottom 0.254: v9.97,40.3 6.62,40.3 6.1,39.78 v6.1,39.52
N$4
  Bottom 0.254: R20.2 LED1.1
N$9
  Top 0.254: Q2.1 16.4,40.1 R7.2
N$11
  Top 0.254: Q1.1 16.46,35.46 17.48,35.46 18.41,36.39 19.79,36.39 20.22,36.81 20.22,38.7 20.32,38.8 20.32,41.17 19.3,42.19 16.64,42.19 16.34,41.9 R8.2
N$12
  Top 0.254: R12.2 24.98,6.59 25.15,6.76 25.15,7.01 25.33,7.2 RX.2
N$13
  Top 0.254: R10.2 21.43,6.59 22.03,7.2 TX.2
N$15
  Top 0.406: CHRG.2 11.3,6.63 11.81,6.12 12.66,6.12 R13.2
N$16
  Top 0.406: R14.2 7.4,5.23 7.87,5.23 8.09,5.45 8.09,5.9 8.57,6.38 8.89,6.38 9.14,6.63 STBY.2
N$18  (via drill 0.35)
  Bottom 0.254: U3.2 8.76,10.38 8.76,15.39 9.53,16.15 9.53,17.55 9.11,17.97 R15.2
  other vias: 9.65,9.49 8.76,17.97
N$19  (via drill 0.35)
  Top 0.254: R16.1 C24.2 5.37,34.1 5.08,33.81 v5.08,33.55 | IC6.5 5.21,28.47 5.33,28.6 5.33,30.12 5.08,30.38 v5.08,32.02
  Bottom 0.254: v5.08,32.02 v5.08,33.55
N$20  (via drill 0.35)
  Top 0.254: Q4.4 10.2,23.31 10.79,23.9 v12.45,23.9 | v2.41,30.25 1.78,30.25 1.62,30.09 IC6.1 | v17.28,22.11 17.65,21.74 v19.25,21.74
  Bottom 0.254: v2.41,30.25 6.22,30.25 7.01,31.04 12.88,31.04 18.59,25.33 18.59,22.96 19.25,22.31 v19.25,21.74 | v12.45,23.9 14.73,23.9 15.24,24.41 15.24,24.79 15.49,25.04 16.76,25.04 17.3,24.51 17.3,22.99 17.27,22.97 v17.27,22.12 v17.28,22.11
N$21  (via drill 0.35)
  Top 0.254: v3.3,39.52 3.3,39.65 3.81,40.16 4.7,40.16 4.99,40.45 R17.2
  Bottom 0.254: IC6.2 1.62,30.86 2.03,31.27 2.79,31.27 3.3,31.78 v3.3,39.52
  other vias: 1.62,28.47
N$26  (via drill 0.35)
  Top 0.254: Q4.5 10.2,18.65 v9.91,18.95 | IC6.3 1.62,27.09 v2.14,26.57 | v2.62,17.65 2.84,17.42 3.68,17.42 4.34,18.08 v4.34,18.24
  Bottom 0.254: v9.91,18.95 8.32,18.95 7.66,18.29 4.39,18.29 v4.34,18.24 | v2.14,26.57 2.14,26.22 2.62,25.74 2.62,24.06 1.95,23.39 1.95,21.06 1.88,21 1.88,19.67 2.4,19.15 2.4,18.58 2.62,18.36 v2.62,17.65
RTS  (via drill 0.35)
  Top 0.254: IC1.2 8.04,29.81 8.36,30.12 8.36,31.32 8.64,31.6 v8.64,33.48 | v16.38,37.74 16.4,37.73 Q2.2 19.62,36.79 19.81,36.98 19.81,40.92 19.3,41.43 R8.1
  Bottom 0.254: v8.64,33.48 8.64,33.73 9.27,34.37 9.27,38.13 9.4,38.25 12.57,38.25 12.83,38 16.13,38 v16.38,37.74
SCL  (via drill 0.35)
  Top 0.254: 29.21,9.99 ESP32.36 29.26,8.33 v29.21,8.28
  Bottom 0.254: v29.21,8.28 29.21,3.45 29.08,3.33 24.38,3.33 23.62,2.57 U$1.4
SDA  (via drill 0.35)
  Top 0.254: ESP32.33 25.4,9.89 25.4,8.92 24.89,8.41 v24.77,8.41
  Bottom 0.254: v24.77,8.41 24.77,7.77 25.27,7.26 26.67,7.26 27.3,6.63 27.3,5.11 25.93,3.73 21.62,3.73 21.08,3.2 U$1.3
STBY  (via drill 0.35)
  Top 0.254: v10.22,6.38 9.97,6.12 9.53,6.12 9.14,5.74 STBY.1
  Bottom 0.254: v10.22,6.38 10.22,7.46 10.57,7.8 12.51,7.8 12.68,7.62 13.61,7.62 14.1,8.11 14.1,11.33 10.99,14.44 U3.6
  other vias: 10.92,14.44
U0RXD  (via drill 0.35)
  Top 0.254: ESP32.34 26.72,13.46 v26.67,13.51 | IC1.20 11.05,30.44 10.92,30.32 v10.92,30.1
  Bottom 0.254: v26.67,13.51 25.8,13.51 25.55,13.26 19.34,13.26 18.82,13.78 18.82,18.23 18.59,18.46 18.59,22.31 18.19,22.71 18.19,24.77 17,25.96 14.39,25.96 13.5,26.85 13.43,26.92 10.92,29.43 v10.92,30.1
U0TXD  (via drill 0.35)
  Top 0.254: v27.94,12.09 27.99,12.04 ESP32.35 | IC1.4 7.81,28.54 8.11,28.24 v8.11,27.73
  Bottom 0.254: v27.94,12.09 27.18,12.85 19.18,12.85 18.67,13.36 18.41,13.61 18.41,18.06 18.18,18.29 18.18,22.14 17.78,22.55 17.78,24.54 17.7,24.62 17.7,24.68 16.83,25.55 14.22,25.55 11.43,28.35 9.14,28.35 8.53,27.73 v8.11,27.73
V+  (via drill 0.35)
  Top 0.254: C23.2 13.94,36.69 v13.84,36.6
  Top 0.406: D1.C 9.91,33.65 v9.91,32.79 9.4,32.28 v9.4,30.38 | U6.2 5.89,22.83 5.59,23.14 4.32,23.14 3.51,23.95 BATT_SW.1 3.51,25.76 3.94,26.19 v5.21,26.19
  Bottom 0.254: v13.84,36.6 13.08,36.6 12.83,36.35 12.83,34.19 13.08,33.93 13.08,32.28 12.83,32.03 11.81,32.03 11.05,32.79 v9.91,32.79
  Bottom 0.406: v5.21,26.19 6.35,26.19 6.6,26.44 6.6,29.49 7.11,30 9.01,30 v9.4,30.38
VBAT+  (via drill 0.35)
  Top 0.254: C25.2 6.95,36.64 6.69,36.89 R16.2 5.5,36.89 5.33,36.73 5.33,34.82 4.57,34.06 4.57,33.98 4.42,33.83 4.42,33.2 3.74,32.51 3.74,32.08 3.05,31.39 v3.05,26.57 | U3.5 12.57,14.44 12.95,14.82 12.95,19.08 12.32,19.71 v9.37,19.71 | U6.3 7.37,20.35 v7.9,19.81 | v2.54,20.73 3.02,20.25 3.97,20.25 v4.45,20.73
  Top 0.406: P1.2 16.02,8.01 15.75,8.28 14.48,8.28 14.22,8.53 14.22,10.57 12.29,12.5 12.29,13.32 12.19,13.42 U3.5
  Bottom 0.254: v9.37,19.71 8,19.71 v7.9,19.81 7.9,19.1 7.49,18.69 6.35,18.69 5.59,19.46 5.59,20.18 5.04,20.73 v4.45,20.73 | v3.05,26.57 3.05,25.62 3.02,25.59 3.02,23.89 2.86,23.73 2.86,22.19 2.41,21.74 2.41,20.85 v2.54,20.73
VBAT-  (via drill 0.35)
  Top 0.254: Q4.3 Q4.2
  Top 0.305: IC6.6 4.22,30.03 4.65,30.45 4.65,31.49 4.4,31.74 4.4,32.31 4.88,32.79 6.19,32.79 C24.1
  Top 0.406: P1.1 18.02,8.03 v18.03,8.05 | v12.06,20.9 11.38,20.9 10.85,21.43 Q4.3 | C24.1 6.22,31.9 v6.35,31.78 | v19.81,24.03 19.43,23.65 17.02,23.65 v16.64,23.27
  Bottom 0.406: v18.03,8.05 18.03,12.85 16.51,14.38 16.51,21.87 16.26,22.12 | 16.26,22.12 12.95,22.12 12.06,21.23 v12.06,20.9 | v6.35,31.78 6.6,31.52 13.08,31.52 18.16,26.44 19.43,26.44 19.81,26.06 v19.81,24.03 | v16.64,23.27 16.64,22.5 16.26,22.12
VBUS  (via drill 0.35)
  Top 0.152: R5.2 14.69,31.39 14.48,31.39
  Top 0.254: R14.1 7.24,6.92 | C18.2 3.85,5.2 3.05,5.99 3.05,10.69 4.04,11.68 v4.7,11.68 | 7.56,14.44 v7.45,14.44
  Top 0.406: USB.A4_B9 7.51,14.49 7.56,14.44 U3.8 8.38,15.14 7.87,15.65 7.87,18.69 8.26,19.08 8.38,19.08 8.64,19.33 8.64,21.49 8.31,21.82 U6.1 8.31,24.08 9.4,25.17 9.4,25.81 10.86,27.27 IC1.15 13.27,27.27 14.22,28.22 14.22,30.25 13.72,30.76 13.72,31.39 | USB.B4_A9 7.48,9.69 v7.49,9.68 | C18.2 C19.1 6.19,5.2 6.54,5.54 6.54,5.79 7.37,6.62 R14.1 | R13.1 13.08,9.04 12.63,9.49 U3.4 | 13.72,31.39 13.72,31.52 13.24,32 D1.A | 13.72,31.39 14.48,31.39 14.7,31.39
  Bottom 0.254: v4.7,11.68 6.12,11.68 | v7.49,9.68 7.49,10.31 6.12,11.68 | v7.45,14.44 7.45,12.93 6.2,11.68 6.12,11.68
  Bottom 0.406: v7.49,9.68 8.26,9.68 9.18,8.75 10.25,8.75 10.99,9.49 U3.4
  other vias: 12.19,9.49
VCC  (via drill 0.35)
  Top 0.254: R10.1 20.16,5.14 20.07,5.23 20.07,7.52 v20.57,8.03 23.32,8.03 23.59,7.76 23.59,7.68 23.66,7.61 23.66,5.33 23.84,5.14 R12.1 | 12.57,26 13.15,26 13.28,25.86 13.28,25.1 13.46,24.92 20.32,24.92 v20.57,24.66 v20.57,11.96 | 12.57,26 IC1.13 IC1.14 | v13.72,34.57 13.72,35.08 14.01,35.37 C17.1 | IC1.3 8.11,29.17 v8.13,29.15 | v10.81,26.18 10.92,26.06 12.51,26.06 12.57,26
  Bottom 0.254: v20.57,8.03 v20.57,11.96 | v20.57,24.66 20.57,25.98 19.63,26.92 18.57,26.92 13.72,31.78 v13.72,34.57 | v8.13,29.15 8.13,28.6 8,28.47 7.49,28.47 7.37,28.35 7.37,27.33 7.62,27.08 8.38,27.08 8.51,27.2 8.58,27.2 9.31,27.94 10.41,27.94 10.67,27.69 10.67,26.31 v10.81,26.18

### Text on the board
tNames: ON | OFF